# Altium schematic sheet power.SchDoc
size A4; Organization: Medical Technologies CZ a.s.; SheetNumber: 3; SheetTotal: 10; Version1: N/A; Version2: N/A; Version3: N/A; Change1description: N/A; Change2description: N/A; Change3description: N/A; Change1DrawnBy: N/A; Change2DrawnBy: N/A; Change3DrawnBy: N/A; Change1CheckedBy: N/A; Change2CheckedBy: N/A; Change3CheckedBy: N/A; PreviusVersion_Chng1: N/A; PreviusVersion_Chng2: N/A; PreviusVersion_Chng3: N/A; Variant1description: Standard assembly; Variant2description: N/A; Variant3description: N/A; Variant4description: N/A; PrimaryCard1: XXXxxxXXX; PrimaryCard2: N/A; PrimaryCard3: N/A; PrimaryCard4: N/A; SPICEModelCachePWZRLVOU: <root> / <DocumentId>PWZRLVOU</DocumentId> / <CacheFrame Number="0"> / <Model Name="grm188r72a104ka35" Kind="CKT"> / <Text>*---------------------------------------------------------------------- / * SPICE Model generated by Murata Manufacturing Co., Ltd. / * Copyright(C) Murata Manufacturing Co., Ltd. / * Description :1608M(0603)/X7R/0.1uF/100V / * Murata P/N :GRM188R72A104KA35 / * Property : C = 0.1[uF] / *---------------------------------------------------------------------- / * Applicable Conditions: / *   Frequency Range = 100Hz-6GHz / *   Temperature = 25 degC / *   DC Bias Voltage = 0V / *   Small Signal Operation / *---------------------------------------------------------------------- / .SUBCKT GRM188R72A104KA35 port1 port2 / C1 port1 11 9.94e-8 / L2 11 12 1.68e-10 / R3 12 13 1.35e-2 / C4 13 14 1.39e-5 / R4 13 14 285 / C5 14 15 2.35e-5 / R5 14 15 28.5 / C6 15 16 1.88e-5 / R6 15 16 7.00 / C7 16 17 1.68e-5 / R7 16 17 9.47e-1 / C8 17 18 1.50e-5 / R8 17 18 1.51e-1 / C9 18 19 1.07e-5 / R9 18 19 2.98e-2 / C10 19 20 1.31e-5 / R10 19 20 3.83e-3 / L11 20 21 1.43e-11 / R11 20 21 8.15e-2 / L12 21 22 1.08e-10 / R12 21 22 7.26e-2 / C13 22 23 4.76e-7 / L13 22 23 2.94e-11 / R13 22 23 3.05e-2 / C14 23 24 1.58e-7 / L14 23 24 2.63e-11 / R14 23 24 2.63e-2 / C15 24 port2 3.33e-12 / L15 24 port2 1.14e-10 / R15 24 port2 22.5 / R100 port1 11 5.00e+9 / .ENDS GRM188R72A104KA35</Text> / </Model> / <Model Name="ssa34" Kind="CKT"> / <Text>********************************** / * Copyright:                     * / *   Thomatronik GmbH, Germany    * / *   info@thomatronik.de          * / ********************************** / *   SPICE3 / .subckt ssa34 1 2 / ddio 1 2 legd / dgr 1 2 grd / .model legd d is = 1.73647E-006 n = 1.01682 rs = 0.0395584 / + eg = 0.4 xti = 0.200031 tnom = 27 / + cjo = 8.10972E-010 vj = 0.700021 m = 0.588084 fc = 0.5 / + tt = 1.4427E-009 bv = 44 ibv = 1 af = 1 kf = 0 / .model grd d is = 6.76885E-008 n = 0.972506 rs = 0.0698092 / + eg = 1 xti = 0.2 tnom = 27 / .ends</Text> / </Model> / <Model Name="grt188r61h105ke13" Kind="CKT"> / <Text>*---------------------------------------------------------------------- / * SPICE Model generated by Murata Manufacturing Co., Ltd. / * Copyright(C) Murata Manufacturing Co., Ltd. / * Description :1608M(0603)/X5R/1uF/50V / * Murata P/N :GRT188R61H105KE13 / * Property : C = 1[uF] / *---------------------------------------------------------------------- / * Applicable Conditions: / *   Frequency Range = 100Hz-6GHz / *   Temperature = 25 degC / *   DC Bias Voltage = 5V / *   Small Signal Operation / *---------------------------------------------------------------------- / .SUBCKT GRT188R61H105KE13 port1 port2 / C1 port1 11 7.62e-7 / L2 11 12 1.16e-10 / R3 12 13 7.65e-3 / C4 13 14 3.94e-6 / R4 13 14 1.77e+3 / C5 14 15 1.75e-5 / R5 14 15 15.4 / C6 15 16 1.51e-5 / R6 15 16 1.76 / C7 16 17 1.17e-5 / R7 16 17 2.01e-1 / C8 17 18 8.13e-6 / R8 17 18 2.61e-2 / L9 18 19 2.29e-11 / R9 18 19 8.12e-2 / L10 19 20 1.53e-10 / R10 19 20 4.15e-2 / C11 20 21 2.62e-6 / L11 20 21 3.15e-11 / R11 20 21 1.12e-2 / C12 21 22 7.84e-7 / L12 21 22 5.54e-11 / R12 21 22 1.32e-2 / C13 22 port2 1.55e-12 / L13 22 port2 1.73e-10 / R13 22 port2 64.4 / R100 port1 11 5.00e+7 / .ENDS GRT188R61H105KE13</Text> / </Model> / <Model Name="c1608c0g1h103j080aa_p" Kind="CKT"> / <Text>*---------------------------------------------------------------------- / * SPICE Netlist Generated by TDK Corporation / * Copyright(C) 2015 TDK Corporation. / * All Rights Reserved. / *---------------------------------------------------------------------- / * TDK P/N: C1608C0G1H103J080AA (Multilayer Ceramic Chip Capacitor) / * Property: C=10nF / * Size(LxWxT): 1.6x0.8x0.8mm, 0.063x0.031x0.031inches / * Model Type: Precise Model / * Model Generated on June 29, 2015 / *---------------------------------------------------------------------- / * Terms and conditions regarding TDK Simulation Models: / * 1)This simulation model is being provided solely for informational / *   purposes. Please refer to the specifications of the products in / *   terms of detailed characteristics of such products. / * 2)In no event shall TDK Corporation of any of its subsidiaries be / *   liable for any loss or damage arising, directly or indirectly, / *   from any information contained in this simulation model, including, / *   but not limited to loss or damages arising from any inaccuracies, / *   omissions or errors in connection with such information. / * 3)Any and all copyrights on this simulation model are owned by / *   TDK Corporation.  Duplication or redistribution of this simulation / *   model without prior written permission from TDK Corporation / *   is prohibited. / * 4)This simulation model is subject to any modification or change / *   without any prior notice. / * 5)Neither TDK Corporation nor any of its subsidiaries shall make any / *   warranty, express or implied, including but not limited to the / *   correctness, implied warranties of merchantability and fitness for / *   a particular purpose with respect to this simulation models. / * 6)The use of this simulation model shall be deemed to have consented / *   to the terms and conditions hereof. / *---------------------------------------------------------------------- / * External Node Assignments: / * / *  n1 ---| |--- n2 / * / *---------------------------------------------------------------------- / * Applicable Conditions: / *   Temperature = 25 degC / *   DC Bias Voltage = 0 V / *   Small Signal Operation / *---------------------------------------------------------------------- / .SUBCKT C1608C0G1H103J080AA_p n1 n2 / C1 n1 11 1.00000000E-08 / L1 11 12 3.87447524E-10 / L2 12 13 3.02537762E-11 / L3 13 14 6.87230213E-11 / L4 14 15 1.66916342E-10 / L5 15 16 4.94708926E-10 / R1 n2 12 7.79169483E-02 / R2 n2 13 3.60336449E-02 / R3 n2 14 1.66641994E-02 / R4 n2 15 7.70656268E-03 / R5 n2 16 3.56399409E-03 / R6 n1 11 1.00000000E+10 / .ENDS C1608C0G1H103J080AA_p</Text> / </Model> / <Model Name="c1608x7r1h474k080ac_p" Kind="CKT"> / <Text>*---------------------------------------------------------------------- / * SPICE Netlist Generated by TDK Corporation / * Copyright(C) 2015 TDK Corporation. / * All Rights Reserved. / *---------------------------------------------------------------------- / * TDK P/N: C1608X7R1H474K080AC (Multilayer Ceramic Chip Capacitor) / * Property: C=470nF / * Size(LxWxT): 1.6x0.8x0.8mm, 0.063x0.031x0.031inches / * Model Type: Precise Model / * Model Generated on June 29, 2015 / *---------------------------------------------------------------------- / * Terms and conditions regarding TDK Simulation Models: / * 1)This simulation model is being provided solely for informational / *   purposes. Please refer to the specifications of the products in / *   terms of detailed characteristics of such products. / * 2)In no event shall TDK Corporation of any of its subsidiaries be / *   liable for any loss or damage arising, directly or indirectly, / *   from any information contained in this simulation model, including, / *   but not limited to loss or damages arising from any inaccuracies, / *   omissions or errors in connection with such information. / * 3)Any and all copyrights on this simulation model are owned by / *   TDK Corporation.  Duplication or redistribution of this simulation / *   model without prior written permission from TDK Corporation / *   is prohibited. / * 4)This simulation model is subject to any modification or change / *   without any prior notice. / * 5)Neither TDK Corporation nor any of its subsidiaries shall make any / *   warranty, express or implied, including but not limited to the / *   correctness, implied warranties of merchantability and fitness for / *   a particular purpose with respect to this simulation models. / * 6)The use of this simulation model shall be deemed to have consented / *   to the terms and conditions hereof. / *---------------------------------------------------------------------- / * External Node Assignments: / * / *  n1 ---| |--- n2 / * / *---------------------------------------------------------------------- / * Applicable Conditions: / *   Temperature = 25 degC / *   DC Bias Voltage = 0 V / *   Small Signal Operation / *---------------------------------------------------------------------- / .SUBCKT C1608X7R1H474K080AC_p n1 n2 / C1 n1 11 4.47810483E-07 / C2 n1 12 5.67609918E-09 / C3 n1 13 5.67609918E-09 / C4 n1 14 5.67609918E-09 / C5 n1 15 5.67609918E-09 / C6 n1 16 5.67609918E-09 / C7 n1 17 5.67609918E-09 / L1 n2 21 4.20000000E-10 / R1 11 21 9.27347124E-03 / R2 11 12 5.00450244E+01 / R3 11 13 3.23698218E+02 / R4 11 14 2.09308839E+03 / R5 11 15 1.35302521E+04 / R6 11 16 8.74376255E+04 / R7 11 17 5.64895275E+05 / R8 n1 11 1.06000000E+09 / .ENDS C1608X7R1H474K080AC_p</Text> / </Model> / </CacheFrame> / </root>; DocumentName: Docname
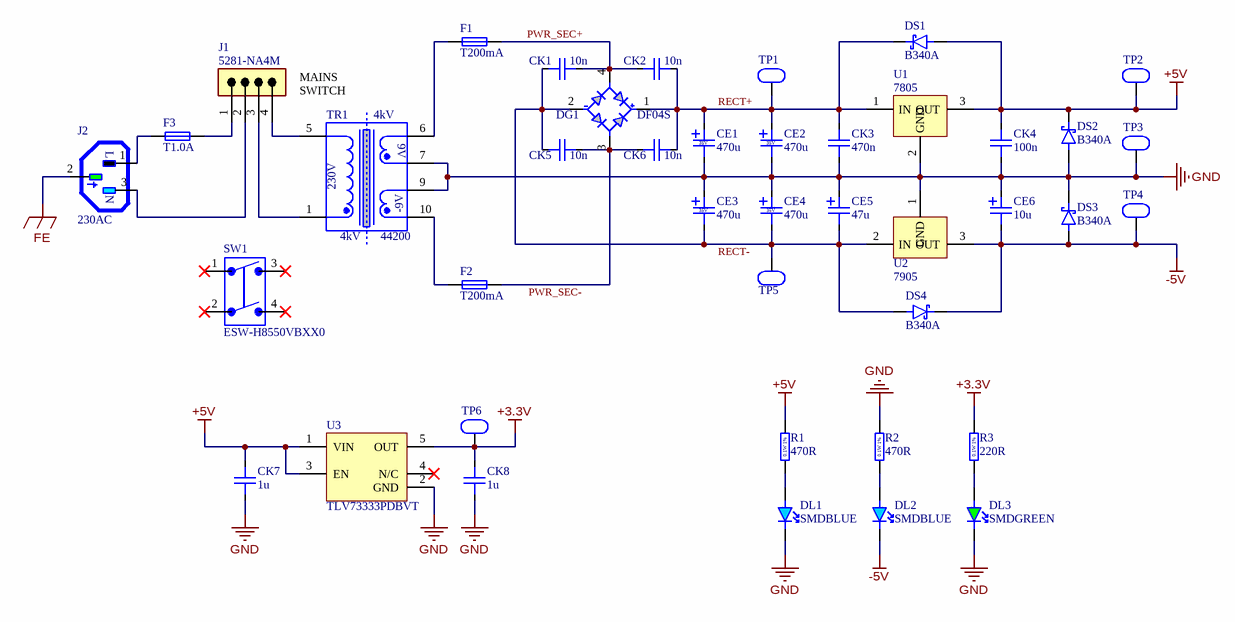
[diagram p0: power.SchDoc]

## Parts
CE1  470u  SCH_INFO: 35V
CE2  470u  SCH_INFO: 35V
CE3  470u  SCH_INFO: 35V
CE4  470u  SCH_INFO: 35V
CE5  47u  [CAPAE6.8X6.8(D_SIZE)]
CE6  10u  [CAPAE5.5X5.5(C_SIZE)]
CK1  10n  [CAPC1608X09N(SMC0603)]
CK2  10n  [CAPC1608X09N(SMC0603)]
CK3  470n  [CAPC1608X09N(SMC0603)]
CK4  100n  [CAPC1608X09N(SMC0603)]
CK5  10n  [CAPC1608X09N(SMC0603)]
CK6  10n  [CAPC1608X09N(SMC0603)]
CK7  1u  [CAPC1608X09N(SMC0603)]
CK8  1u  [CAPC1608X09N(SMC0603)]
DG1  DF04S  [DIP300RM5.08_SMD]
DL1  SMDBLUE  [DIOC2012X12N(SMLED0805)B]
DL2  SMDBLUE  [DIOC2012X12N(SMLED0805)B]
DL3  SMDGREEN  [DIOC2012X12N(SMLED0805)G]
DS1  B340A  [DIOM5127X23N(SMA)]
DS2  B340A  [DIOM5127X23N(SMA)]
DS3  B340A  [DIOM5127X23N(SMA)]
DS4  B340A  [DIOM5127X23N(SMA)]
F1  T200mA  [FUSE-C8.5]
F2  T200mA  [FUSE-C8.5]
F3  T1.0A  [FUSE-C8.5]
J1  5281-NA4M  [4P-NA-5.08]
J2  230AC  [SCHURTER_GSP1.8501.1]
R1  470R  SCH_INFO: 0.1W 1%  [RESC1608X06N(SMR0603)]
R2  470R  SCH_INFO: 0.1W 1%  [RESC1608X06N(SMR0603)]
R3  220R  SCH_INFO: 0.1W 1%  [RESC1608X06N(SMR0603)]
SW1  ESW-H8550VBXX0
TP1  Test Point  [SMD_Testpoint_Onelayer]  (value not drawn)
TP2  Test Point  [SMD_Testpoint_Onelayer]  (value not drawn)
TP3  Test Point  [SMD_Testpoint_Onelayer]  (value not drawn)
TP4  Test Point  [SMD_Testpoint_Onelayer]  (value not drawn)
TP5  Test Point  [SMD_Testpoint_Onelayer]  (value not drawn)
TP6  Test Point  [SMD_Testpoint_Onelayer]  (value not drawn)
TR1  44200  [44200]
U1  7805  [DPAK254P1544X483-3N(D2PAK)]
U2  7905  [DPAK254P1544X483-3N(D2PAK)]
U3  TLV73333PDBVT  [SOT95P280X145-5N(SOT23-5)]

## Nets
+3.3V: CK8.1 R3.2 TP6.1 U3.5(OUT)
+5V: CK4.1 CK7.1 DS1.2(A) DS2.1(C) R1.2 TP2.1 U1.3(OUT) U3.1(VIN) U3.3(EN)
-5V: CE6.2 DL2.1(C) DS3.2(A) DS4.1(C) TP4.1 U2.3(OUT)
FE: J2.2
GND: CE1.2 CE2.2 CE3.1 CE4.1 CE5.1 CE6.1 CK3.2 CK4.2 CK7.2 CK8.2 DL1.1(C) DL3.1(C) DS2.2(A) DS3.1(C) R2.2 TP3.1 TR1.7 TR1.9 U1.2(GND) U2.1(GND) U3.2(GND)
PWR_SEC+: CK1.2 CK2.1 DG1.4(AC) F1.2
PWR_SEC-: CK5.2 CK6.1 DG1.3(AC) F2.2
RECT+: CE1.1 CE2.1 CK2.2 CK3.1 CK6.2 DG1.1(+) DS1.1(C) TP1.1 U1.1(IN)
RECT-: CE3.2 CE4.2 CE5.2 CK1.1 CK5.1 DG1.2(-) DS4.2(A) TP5.1 U2.2(IN)
NetDL1_2: DL1.2(A) R1.1
NetDL2_2: DL2.2(A) R2.1
NetDL3_2: DL3.2(A) R3.1
NetF1_1: F1.1 TR1.6
NetF2_1: F2.1 TR1.10
NetF3_1: F3.1 J2.1
NetF3_2: F3.2 J1.1
NetJ1_2: J1.2 J2.3
NetJ1_3: J1.3 TR1.1
NetJ1_4: J1.4 TR1.5

Not connected (* = marked no-connect by the designer): SW1 1* 2* 3* 4*; U3 4(N/C)*

## Notes on the sheet
- MAINS SWITCH
- Číslo výkresu /drawing number/:
- Nazev listu/sheet name/:
- DPS projekt/PCB project/:
- Kreslil /drawn by/ :
- Kontroloval /checked by/:
- Datum /date/:
- List /sheet/:
- /
- (in symbol 44200) 4kV; 9V; 230V; -9V
- (in symbol EJ-GSP1SC1) L; N

## Library data of the parts
CE1-CE4 = ECE-470U35VXXM: C; 470u; 35V; 20%; Aluminum Electrolytic; ??;; Manufacturer: SU'SCON: SL035M471G16T008P50R;;SU'SCON: SL035M471G16SR;;SAMWHA: SD1V477M1012MPA159;;SAMWHA: SD1V477M1012MPA186; Component_Class: Capacitor; Status_I: Production; Status_II: Active; Tolerance_Pct: 20; Voltage_Rating_V: 35; Capacitance_F: 0.00047; Resistance_Ohm: 0.039; KK: ECE-470U35VXXM; Value: 470u; SMD: 0; ComponentLink2URL: i:\datasheets\ECE-470U35VXXM_Jamicon.pdf; ComponentLink2Description: ECE-470U35VXXM_Jamicon.pdf; Dielectric_Type: Aluminum Electrolytic; ComponentLink1URL: heliosgreen://v1/hegMT/5-MT/Classes(343)/Folders/OpenForm?RecordNumbers=[380299]; ComponentLink1Description: Helios; ComponentLink3URL: i:\datasheets\ECE-470U35VXXM_SamwhaEN100.pdf; ComponentLink3Description: ECE-470U35VXXM_SamwhaEN100.pdf
CE5 = ECE+47U35VXX0: C; 47u; 35V; 20%; Aluminum Electrolytic; ??;; Manufacturer: Surge, MPN: SVZ21V470M0605V1; Component_Class: Capacitor; Status_I: Production; Status_II: Active; Tolerance_Pct: 20; Voltage_Rating_V: 35; Capacitance_F: 4.7E-5; KK: ECE+47U35VXX0; Value: 47u; SMD: 1; ComponentLink2URL: I:\DataSheets\ECE+47U35VXX0_SurgeEN100.pdf; ComponentLink2Description: ECE+47U35VXX0_SurgeEN100.pdf; Dielectric_Type: Aluminum Electrolytic; ComponentLink1URL: heliosgreen://v1/hegMT/5-MT/Classes(343)/Folders/OpenForm?RecordNumbers=[18329439]; ComponentLink1Description: Helios
CE6 = ECE+10U35VXXM: C; 10u; 35V; 20%; Aluminum Electrolytic; ??;; Manufacturer: SAMWHA: SC1V106M05005VR259;;SAMWHA: SC1V106M05005VR289; Component_Class: Capacitor; Status_I: Production; Status_II: Active; Tolerance_Pct: 20; Voltage_Rating_V: 35; Capacitance_F: 1E-5; KK: ECE+10U35VXXM; Value: 10u; SMD: 1; ComponentLink2URL: i:\datasheets\ECE+10U35VXXM_Nippon.pdf; ComponentLink2Description: ECE+10U35VXXM_Nippon.pdf; ComponentLink3URL: i:\datasheets\ECE+10U35VXXM_Jamicon.pdf; ComponentLink3Description: ECE+10U35VXXM_Jamicon.pdf; ComponentLink4URL: i:\datasheets\ECE+10U35VXXM_Panasonic_serie_ECEV.pdf; ComponentLink4Description: ECE+10U35VXXM_Panasonic_serie_ECEV.pdf; ComponentLink5URL: i:\DataSheets\ECE+10U35VXXM_Shamwha.pdf; ComponentLink5Description: ECE+10U35VXXM_Shamwha.pdf; ComponentLink6URL: i:\DataSheets\SMD_parts_pictures\ECE+10U35VXXM-a.jpg; ComponentLink6Description: ECE+10U35VXXM-a.jpg; ComponentLink7URL: i:\DataSheets\SMD_parts_pictures\ECE+10U35VXXM-b.jpg; ComponentLink7Description: ECE+10U35VXXM-b.jpg; ComponentLink8URL: i:\DataSheets\SMD_parts_pictures\ECE+10U35VXXM-c.jpg; ComponentLink8Description: ECE+10U35VXXM-c.jpg; Resistance_Ohm: 20; Dielectric_Type: Aluminum Electrolytic; ComponentLink1URL: heliosgreen://v1/hegMT/5-MT/Classes(343)/Folders/OpenForm?RecordNumbers=[380259]; ComponentLink1Description: Helios
CK1 CK2 CK5 CK6 = ECK+10N50V0603XX0: C; 10n; 50V; 5%; NP0/C0G; ??;; Manufacturer: TDK: C1608C0G1H103J080AA; Component_Class: Capacitor; Status_I: Production; Status_II: Do not order. Upon confirmation.; Tolerance_Pct: 5; Voltage_Rating_V: 50; Capacitance_F: 1E-8; KK: ECK+10N50V0603XX0; Value: 10n; SMD: 1; ComponentLink2URL: I:\DataSheets\ECK+10N50V0603XX0_TdkEN100.pdf; ComponentLink2Description: ECK+10N50V0603XX0_TdkEN100.pdf; Dielectric_Type: NP0/C0G; ComponentLink1URL: heliosgreen://v1/hegMT/5-MT/Classes(343)/Folders/OpenForm?RecordNumbers=[12587254]; ComponentLink1Description: Helios
CK3 = ECK+470N50V0603XXK: C; 470n; 50V; 10%; X7R; ??;; Manufacturer: TDK: C1608X7R1H474KT-S;;TDK: C1608X7R1H474KT000E;;TDK: C1608X7R1H474K080AC; Note: X7R: 440n @ 5V, 330n @ 12V, 170n @ 25V (TDK); Component_Class: Capacitor; Status_I: Production; Status_II: Active; Tolerance_Pct: 10; Voltage_Rating_V: 50; Capacitance_F: 4.7E-7; KK: ECK+470N50V0603XXK; Value: 470n; SMD: 1; ComponentLink2URL: i:\datasheets\ECK+470N50V0603XXK_TDKEN100.pdf; ComponentLink2Description: ECK+470N50V0603XXK_TDKEN100.pdf; Dielectric_Type: X7R; ComponentLink1URL: heliosgreen://v1/hegMT/5-MT/Classes(343)/Folders/OpenForm?RecordNumbers=[6094421]; ComponentLink1Description: Helios
CK4 = ECK+100N100VXX0: C; 100n; 100V; 10%; X7R; ??;; Manufacturer: Murata Electronics: GRM188R72A104KA35D;;Yageo: CC0603KRX7R0BB104; Component_Class: Capacitor; Status_I: Production; Status_II: Active; Tolerance_Pct: 10; Voltage_Rating_V: 100; Capacitance_F: 1E-7; KK: ECK+100N100VXX0; Value: 100n; SMD: 1; ComponentLink2URL: I:\DataSheets\ECK+100N100VXX0_MurataEN100.pdf; ComponentLink2Description: ECK+100N100VXX0_MurataEN100.pdf; ComponentLink3URL: I:\DataSheets\ECK+100N100VXX0_YageoEN100.pdf; ComponentLink3Description: ECK+100N100VXX0_YageoEN100.pdf; ComponentLink4URL: i:\DataSheets\ECK+100N100VXX0_2_MurataEN100.pdf; ComponentLink4Description: ECK+100N100VXX0_2_MurataEN100.pdf; ComponentLink5URL: i:\DataSheets\ECK+100N100VXX0_2_YageoEN100.pdf; ComponentLink5Description: ECK+100N100VXX0_2_YageoEN100.pdf; Dielectric_Type: X7R; ComponentLink1URL: heliosgreen://v1/hegMT/5-MT/Classes(343)/Folders/OpenForm?RecordNumbers=[10556034]; ComponentLink1Description: Helios
CK7 CK8 = ECK+1U50VXX0: C; 1u; 50V; 10%; X5R; ??;; Manufacturer: TDK: C1608X5R1H105K080AB;;TDK: CGA3E3X5R1H105K080AB;;Murata: GRT188R61H105KE13D;;AVX: 06035D105KAT2A; Note: X5R: 0.52uF @ 10V, 0.2uF @ 25V (Murata); Component_Class: Capacitor; Status_I: Production; Status_II: Active; Tolerance_Pct: 10; Voltage_Rating_V: 50; Capacitance_F: 1E-6; KK: ECK+1U50VXX0; Value: 1u; SMD: 1; ComponentLink2URL: i:\DataSheets\ECK+1U50VXX0_TDKEN100.pdf; ComponentLink2Description: ECK+1U50VXX0_TDKEN100.pdf; ComponentLink3URL: I:\DataSheets\ECK+1U50VXX0_AVX_EN100.pdf; ComponentLink3Description: ECK+1U50VXX0_AVX_EN100.pdf; ComponentLink4URL: I:\DataSheets\ECK+1U50VXX0_MurataEN100.pdf; ComponentLink4Description: ECK+1U50VXX0_MurataEN100.pdf; ComponentLink5URL: I:\DataSheets\ECK+1U50VXX0_TDK_EN101.pdf; ComponentLink5Description: ECK+1U50VXX0_TDK_EN101.pdf; ComponentLink6URL: i:\DataSheets\ECK+1U50VXX0_2_AVX_EN100.pdf; ComponentLink6Description: ECK+1U50VXX0_2_AVX_EN100.pdf; Dielectric_Type: X5R; ComponentLink1URL: heliosgreen://v1/hegMT/5-MT/Classes(343)/Folders/OpenForm?RecordNumbers=[9390428]; ComponentLink1Description: Helios
DG1 = EDG+DF04SXX0: D; Bridge; 400V; 1A; 1x;; Manufacturer: YYE: DB107S T/R;;MicroElectronics: DB107S T/R;;GENERAL SEMICONDUCTOR: DF04S(A);;FAI: DF04S;;DIOTEC: B250(F)S; Component_Class: Diode; Status_I: Production; Status_II: Active; Multiplicity: 1; Reverse_Voltage_Rating_V: 400; KK: EDG+DF04SXX0; Value: DF04S; SMD: 1; ComponentLink2URL: i:\DataSheets\EDG+DF04SXX0_Vishay.pdf; ComponentLink2Description: EDG+DF04SXX0_Vishay.pdf; ComponentLink3URL: i:\DataSheets\EDG+DF04SXX0_Fairchild.pdf; ComponentLink3Description: EDG+DF04SXX0_Fairchild.pdf; ComponentLink4URL: i:\DataSheets\SMD_parts_pictures\EDG+DF04SXX0-a.jpg; ComponentLink4Description: EDG+DF04SXX0-a.jpg; Current_Rating_A: 1; Diode_Type: Bridge; ComponentLink1URL: heliosgreen://v1/hegMT/5-MT/Classes(343)/Folders/OpenForm?RecordNumbers=[380577]; ComponentLink1Description: Helios
DL1 DL2 = EDL+SMDBLUEXX0: Ind; Light; Blue;; Manufacturer: MULTICOMP: OVS-0803; Note: 465nm; Component_Class: Indicator; Status_I: Production; Status_II: Active; KK: EDL+SMDBLUEXX0; Value: SMDBLUE; SMD: 1; ComponentLink2URL: i:\DataSheets\EDL+SMDBLUEXX0_Multicomp.pdf; ComponentLink2Description: EDL+SMDBLUEXX0_Multicomp.pdf; Indicator_Type: Light; Indicator_Output: Blue; ComponentLink1URL: heliosgreen://v1/hegMT/5-MT/Classes(343)/Folders/OpenForm?RecordNumbers=[3654099]; ComponentLink1Description: Helios
DL3 = EDL+SMDGREENXX0: Ind; Light; Green;; Manufacturer: HEBEI: 0805KGCT;;BRIGHTLED: BL-HGE35A-AV-TRB; Note: 570nm; Component_Class: Indicator; Status_I: Production; Status_II: Active; KK: EDL+SMDGREENXX0; Value: SMDGREEN; SMD: 1; ComponentLink2URL: i:\datasheets\EDL+SMDGREENXX0_KingBright.pdf; ComponentLink2Description: EDL+SMDGREENXX0_KingBright.pdf; ComponentLink3URL: i:\DataSheets\EDL+SMDGREENXX0_Hebei_EN100.pdf; ComponentLink3Description: EDL+SMDGREENXX0_Hebei_EN100; ComponentLink4URL: i:\DataSheets\EDL+SMDGREENXX0_Brightled_EN100.pdf; ComponentLink4Description: EDL+SMDGREENXX0_Brightled_EN100; Indicator_Type: Light; Indicator_Output: Green; ComponentLink1URL: heliosgreen://v1/hegMT/5-MT/Classes(343)/Folders/OpenForm?RecordNumbers=[380588]; ComponentLink1Description: Helios
DS1-DS4 = EDS+B340AXX0: D; Schottky; 40V; 3A; 1x;; Manufacturer: DIODES INC: B340A-13-F;;ONS: MBRA340T3G;;VISHAY: SSA34;;BOURNS: B340LF;;MCC: SK34A-LTP; Component_Class: Diode; Status_I: Production; Status_II: Active; Multiplicity: 1; Current_Rating_A: 3; Reverse_Voltage_Rating_V: 40; KK: EDS+B340AXX0; Value: B340A; SMD: 1; ComponentLink2URL: i:\DataSheets\EDS+B340AXX0_Vishay.pdf; ComponentLink2Description: EDS+B340AXX0_Vishay.pdf; ComponentLink3URL: i:\datasheets\EDS+B340AXX0_OnSemi.pdf; ComponentLink3Description: EDS+B340AXX0_OnSemi.pdf; ComponentLink4URL: i:\DataSheets\EDS+B340AXX0_Diodes.pdf; ComponentLink4Description: EDS+B340AXX0_Diodes.pdf; ComponentLink5URL: i:\datasheets\EDS+B340AXX0_Bourns.pdf; ComponentLink5Description: EDS+B340AXX0_Bourns.pdf; ComponentLink6URL: I:\DataSheets\EDS+B340AXX0_MCCEN100.pdf; ComponentLink6Description: EDS+B340AXX0_MCCEN100.pdf; Diode_Type: Schottky; ComponentLink1URL: heliosgreen://v1/hegMT/5-MT/Classes(343)/Folders/OpenForm?RecordNumbers=[4517485]; ComponentLink1Description: Helios
F1 F2 = EF-MST0.2ASC0: CP; Current [A]; 0.2; R:No; 1x;; Manufacturer: SCHURTER: MST250 0034.6608;;SCHURTER: MST250 0034.6708; Component_Class: Circuit Protection; Status_I: Production; Status_II: Active; Multiplicity: 1; Resettable: No; Trip_Threshold: 0.2; KK: EF-MST0.2ASC0; Value: T200mA; SMD: 0; ComponentLink2URL: i:\DataSheets\EF-MST_250_Schurter.pdf; ComponentLink2Description: EF-MST_250_Schurter.pdf; Physical_Quantity: Current [A]; ComponentLink1URL: heliosgreen://v1/hegMT/5-MT/Classes(343)/Folders/OpenForm?RecordNumbers=[380401]; ComponentLink1Description: Helios
F3 = EF-MST1.0ASC0: CP; Current [A]; 1; R:No; 1x;; Manufacturer: SCHURTER: 34,6615; Component_Class: Circuit Protection; Status_I: Production; Status_II: Active; Multiplicity: 1; Resettable: No; KK: EF-MST1.0ASC0; Value: T1.0A; SMD: 0; ComponentLink2URL: i:\DataSheets\EF-MSTxASC0_Schurter.pdf; ComponentLink2Description: EF-MSTxASC0_Schurter.pdf; ComponentLink3URL: i:\DataSheets\EF-MST_250_Schurter.pdf; ComponentLink3Description: EF-MST_250_Schurter.pdf; Physical_Quantity: Current [A]; Trip_Threshold: 1; ComponentLink1URL: heliosgreen://v1/hegMT/5-MT/Classes(343)/Folders/OpenForm?RecordNumbers=[380402]; ComponentLink1Description: Helios
J1 = EJ-5281-NA4MX0: Con; Wire to board RM5.04; 4x; PCB; Straight; 250V; 7A; Male; Tin; ??;; Manufacturer: HSUAN MAO: W4508-04PSYTW0R;;HSM: W4508-04PSYTW0R;;MOLEX: 10-32-1041; Component_Class: Connector; Status_I: Production; Status_II: Active; Multiplicity: 4; Voltage_Rating_V: 250; Current_Rating_A: 7; KK: EJ-5281-NA4MX0; Value: 5281-NA4M; SMD: 0; ComponentLink2URL: i:\datasheets\EJ-5281-NA4MX0_HSUAN MAO.pdf; ComponentLink2Description: EJ-5281-NA4MX0_HSUAN MAO.pdf; ComponentLink3URL: i:\datasheets\EJ-5281-NA4MX0_MOLEX.pdf; ComponentLink3Description: EJ-5281-NA4MX0_MOLEX.pdf; Mounting_Style: PCB; Connector_Family: Wire to board RM5.04; Angle: Straight; Gender: Male; Plating: Tin; ComponentLink1URL: heliosgreen://v1/hegMT/5-MT/Classes(343)/Folders/OpenForm?RecordNumbers=[380714]; ComponentLink1Description: Helios; System: Connector
J2 = EJ-GSP1SC1: Con; AC plug; 1x; PCB; ??; 250V; 10A; Male; Tin; ??;; Manufacturer: SCHURTER: GSP1.8501.1; Note: C14; Component_Class: Connector; Status_I: Production; Status_II: Active; Multiplicity: 1; Voltage_Rating_V: 250; Current_Rating_A: 10; Connector_Family: AC plug; KK: EJ-GSP1SC1; SMD: 0; ComponentLink2URL: i:\DataSheets\EJ-GSP1SC1_Schurter.pdf; ComponentLink2Description: EJ-GSP1SC1_Schurter.pdf; ComponentLink3URL: i:\DataSheets\EJ-GSP1SC1_Schurter1.pdf; ComponentLink3Description: EJ-GSP1SC1_Schurter1.pdf; Mounting_Style: PCB; Gender: Male; Plating: Tin; ComponentLink1URL: heliosgreen://v1/hegMT/5-MT/Classes(343)/Folders/OpenForm?RecordNumbers=[380789]; ComponentLink1Description: Helios; System: Connector
R1 = ER+470R0.1WXX2: R; 470R; 0.1W; 1%; 75V; Thick Film; ±100ppm/K; 1x;; Manufacturer: Yageo: RC0603FR-07470RL;;Panasonic: ERJ3EKF4700V; Component_Class: Resistor; Status_I: Production; Status_II: Active; Tolerance_Pct: 1; Resistance_Ohm: 470; Power_Rating_W: 0.1; Temperature_Coefficient_PPMpK: ±100; Voltage_Rating_V: 75; KK: ER+470R0.1WXX2; Value: 470R; SMD: 1; ComponentLink2URL: I:\DataSheets\ER+470R0.1WXX2_YageoEN100.pdf; ComponentLink2Description: ER+470R0.1WXX2_YageoEN100.pdf; Multiplicity: 1; Resistor_Type: Thick Film; ComponentLink1URL: heliosgreen://v1/hegMT/5-MT/Classes(343)/Folders/OpenForm?RecordNumbers=[11656564]; ComponentLink1Description: Helios; ComponentLink3URL: I:\datasheets\ER+470R0.1WXX2_PanasonicEN100.pdf; ComponentLink3Description: ER+470R0.1WXX2_PanasonicEN100.pdf
R2 = ER+470R0.1WXX2: R; 470R; 0.1W; 1%; 75V; Thick Film; ±100ppm/K; 1x;; Manufacturer: Yageo: RC0603FR-07470RL;;Panasonic: ERJ3EKF4700V; Component_Class: Resistor; Status_I: Production; Status_II: Active; Tolerance_Pct: 1; Voltage_Rating_V: 75; Resistance_Ohm: 470; Power_Rating_W: 0.1; Temperature_Coefficient_PPMpK: ±100; KK: ER+470R0.1WXX2; Value: 470R; SMD: 1; ComponentLink2URL: I:\DataSheets\ER+470R0.1WXX2_YageoEN100.pdf; ComponentLink2Description: ER+470R0.1WXX2_YageoEN100.pdf; Multiplicity: 1; Resistor_Type: Thick Film; ComponentLink1URL: heliosgreen://v1/hegMT/5-MT/Classes(343)/Folders/OpenForm?RecordNumbers=[11656564]; ComponentLink1Description: Helios; ComponentLink3URL: I:\datasheets\ER+470R0.1WXX2_PanasonicEN100.pdf; ComponentLink3Description: ER+470R0.1WXX2_PanasonicEN100.pdf
R3 = ER+220R0.1W0603XX0: R; 220R; 0.1W; 1%; 75V; Thick Film; ±100ppm/K; 1x;; Manufacturer: VISHAY: CRCW0603220RFKEA; Component_Class: Resistor; Status_I: Production; Status_II: Active; Tolerance_Pct: 1; Voltage_Rating_V: 75; Resistance_Ohm: 220; Power_Rating_W: 0.1; Temperature_Coefficient_PPMpK: ±100; KK: ER+220R0.1W0603XX0; Value: 220R; SMD: 1; ComponentLink2URL: I:\datasheets\ER+220R0.1W0603XX0_VISHAY_EN100.pdf; ComponentLink2Description: ER+220R0.1W0603XX0_VISHAY_EN100.pdf; Multiplicity: 1; Resistor_Type: Thick Film; ComponentLink1URL: heliosgreen://v1/hegMT/5-MT/Classes(343)/Folders/OpenForm?RecordNumbers=[10455718]; ComponentLink1Description: Helios
SW1 = ESW-H8550VBXX0: MSw; DPST; Panel; 2x; DC:??V; DC:??A; AC:250V; AC:9A; CV:??V; Switch;; Manufacturer: SWITRONIC: R19-20.BBBT;;SWITRONIC: R19-20.BBBT+-G; Note: According to VDE certificate, current up to 4A.; Component_Class: Mechanical Switch; Status_I: Production; Status_II: Active; Multiplicity: 2; Current_Rating_AC_A: 9; Voltage_Rating_AC_V: 250; KK: ESW-H8550VBXX0; SMD: 0; ComponentLink2URL: i:\datasheets\ECOM_declaration of conformity.pdf; ComponentLink2Description: ECOM_declaration of conformity.pdf; ComponentLink3URL: i:\datasheets\ESW-H8550VBXX0_Switronic_page1.gif; ComponentLink3Description: ESW-H8550VBXX0_Switronic_page1.gif; ComponentLink4URL: i:\datasheets\ESW-H8550VBXX0_Switronic_page2.gif; ComponentLink4Description: ESW-H8550VBXX0_Switronic_page2.gif; ComponentLink5URL: I:\DataSheets\Switronic_declaration_LightCountry.pdf; ComponentLink5Description: Switronic_declaration_LightCountry.pdf; Mounting_Style: Panel; Switch_Configuration: DPST; Mechanical_Switch_Type: Switch; ComponentLink1URL: heliosgreen://v1/hegMT/5-MT/Classes(343)/Folders/OpenForm?RecordNumbers=[382013]; ComponentLink1Description: Helios
TP1-TP6 = EJ+TESTPOINTXX0: Con; Test Point; 1x; PCB; ??; ??V; ??A; ??; Tin; Contact;; Manufacturer: Harwin: S1751-46R; Component_Class: Connector; Status_I: Production; Status_II: Active; Multiplicity: 1; KK: EJ+TESTPOINTXX0; Value: Test Point; SMD: 1; ComponentLink2URL: i:\datasheets\EJ+TESTPOINTXX0_HarwinEN100.pdf; ComponentLink2Description: EJ+TESTPOINTXX0_HarwinEN100.pdf; ComponentLink3URL: i:\datasheets\EJ+TESTPOINTXX0_BoardWareEN100.pdf; ComponentLink3Description: EJ+TESTPOINTXX0_BoardWareEN100.pdf; Mounting_Style: PCB; Connector_Family: Test Point; Plating: Tin; Connector_Part: Contact; ComponentLink1URL: heliosgreen://v1/hegMT/5-MT/Classes(343)/Folders/OpenForm?RecordNumbers=[5618398]; ComponentLink1Description: Helios; System: Connector
TR1 = 44200: Transformer 230V/2x9V, 2x178mA; ComponentLink1Description: Datasheet; ComponentLink1URL: https://www.tme.eu/Document/cb1d7fdbe3570188ff28030ca3a4f1cf/Catalogue%20Myrra%202018%20compress%C3%A9.pdf
U1 = L7805AC: Fixed, Three Terminal Pos  Regulator 5V/1A in D2PAK; ComponentLink1Description: Datasheet; ComponentLink1URL: https://www.farnell.com/datasheets/1805459.pdf
U2 = L7905AC: Fixed, Three Terminal Pos  Regulator -5V/1A in D2PAK; ComponentLink1Description: Datasheet; ComponentLink1URL: https://www.farnell.com/datasheets/2581705.pdf
U3 = EU+TLV73333PDBVTXX0: IC; Linear Regulator/Reference; ??V; 5.5V; 1x;; Manufacturer: Texas Instruments: TLV73333PDBVT; Note: 3.3V, 300mA, 1% (1.4% max), Capacitor Free,Low Dropout Regulator; Status_I: Production; Status_II: Active; Multiplicity: 1; Vmax_V: 5.5; KK: EU+TLV73333PDBVTXX0; Value: TLV73333PDBVT; Component_Class: IC; SMD: 1; ComponentLink2URL: I:\DataSheets\EU+TLV73333PDBVTXX0_TexasEN100.pdf; ComponentLink2Description: EU+TLV73333PDBVTXX0_TexasEN100.pdf; IC_Type: Linear Regulator/Reference; ComponentLink1URL: heliosgreen://v1/hegMT/5-MT/Classes(343)/Folders/OpenForm?RecordNumbers=[10961858]; ComponentLink1Description: Helios